# Altium schematic sheet main40v.SchDoc: DE:TMP:11:MAIN:STEP
size 139 x 96 mm; SheetNumber: 1; SheetTotal: 1; PageSetup: Record=PageOptions|CenterHorizontal=True|CenterVertical=True|PrintScale=1.97|XCorrection=1.00|YCorrection=1.00|PrintKind=0|BorderSize=5000000|LeftOffset=0|BottomOffset=0|Orientation=2|PaperLength=1000|PaperWidth=1000|Scale=100|PaperSource=7|PrintQuality=-4|MediaType=1|DitherType=10|PaperKind=Letter|PrintScaleMode=1; CurrentDateFGR: 21-07-2022; ModifiedDateFGR: 21-07-2022; WebFGR: www.abebashop.com; VersionFGR: 20220720
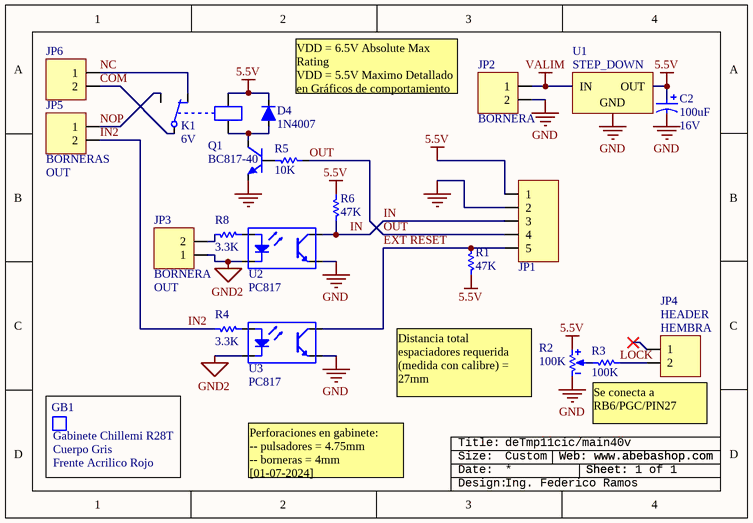
[diagram p0: main40v.SchDoc]

## Parts
C2  value 100uF  Voltaje: 16V  [C_EL_6-3X11]  (hidden comment: Cap Pol)
D4  1N4007  [DIODE300_1MM]
GB1  Gabinete Chillemi R28T  Codigo Chillemi: Cuerpo Gris  Dolares Chillemi: Frente Acrilico Rojo  [PLA_GAB_DIN_4X2_HALF]
JP1  Header5x1  [HDR5x1]  (value not drawn)
JP2  Codigo Elemon: BORNERA  [bornera2]  (hidden comment: XY128V-A2P)
JP3  OUT  Codigo Elemon: BORNERA  [bornera2]
JP4  HEMBRA  Price: HEADER  [HDR2x1]
JP5  Dolares Elemon: BORNERAS  [bornera2]  (hidden comment: XY128V-A2P)
JP6  XY128V-A2P  [bornera2]  (value not drawn)
K1  6V  [RLY_SI_10A_XXV]
Q1  BC817-40  [SOT23]
R1  Resistencia: 47K  [RES300TH]  (hidden comment: Resistencia 1206; 47Kohm)
R2  value 100K  [R_ADJ_METV]  (hidden comment: Preset)
R3  Resistencia: 100K  [R1206]  (hidden comment: Resistencia 1206; 47Kohm)
R4  Resistencia: 3.3K  [R1206]  (hidden comment: Resistencia 1206; 3.3Kohm)
R5  Resistencia: 10K  [R1206]  (hidden comment: Resistencia 1206; 10Kohm)
R6  Resistencia: 47K  [R1206]  (hidden comment: Resistencia 1206; 47Kohm)
R8  Resistencia: 3.3K  [R1206]  (hidden comment: Resistencia 1206; 3.3Kohm)
ROT?  Rotulo  (value not drawn)  (graphical)
U1  STEP_DOWN  [STEP DOWN 20180903 2150]
U2  PC817  [DIP4]
U3  PC817  [DIP4]

## Nets
5.5V: C2.1 D4.2 JP1.1 K1.4 R1.1 R2.1 R6.2 U1.3(OUT)
GND: C2.2 JP1.2 JP2.2 Q1.2(E) R2.3 U1.2(GND) U2.3(E) U3.3(E)
GND2: JP3.1 U2.2(K) U3.2(K)
VALIM: JP2.1 U1.1(IN)
COM: JP6.2 K1.1
EXT RESET: JP1.5 R1.2 U3.4(C)
IN: JP1.3 R6.1 U2.4(C)
IN2: JP5.2 R4.2
LOCK: JP4.2 R3.1
NC: JP6.1 K1.2
NOP: JP5.1 K1.3
OUT: JP1.4 R5.1
NetD4_1: D4.1 K1.5 Q1.3(C)
NetJP3_2: JP3.2 R8.2
NetQ1_1: Q1.1(B) R5.2
NetR2_2: R2.2 R3.2
NetR4_1: R4.1 U3.1(A)
NetR8_1: R8.1 U2.1(A)

Not connected (* = marked no-connect by the designer): JP4 1*

## Notes on the sheet
- (near D4) VDD = 6.5V Absolute Max Rating
  VDD = 5.5V Maximo Detallado en Gráficos de comportamiento (es decir, "recomendable de uso 100% seguro)
- Distancia total espaciadores requerida (medida con calibre) = 27mm
- Perforaciones en gabinete:
  -- pulsadores = 4.75mm
  -- borneras = 4mm
  [01-07-2024]
- Espacio debe sumar 27mm (espaciadores + tuercas + arandela) medir con calibre.
  ALTERNATIVAS YA UTILIZADAS:
  [A] Espaciador Polietileno 5mm (4.85mm exactos) +
  Esp PET 20mm (19.55 exacto) + Tuerca 2.7mm
  L Tornillo Usado = 38mm (cabeza Fresada)
  Altura Lograda con esta opción = 26.6mm
  (se puede sumar una arandela, con lo que sí puede obtener 27mm)
  Agujeros borneras = 4.75mm
  Agujeros pulsadores = 4mm
- deTmp11cic/main40v
- Custom
- (near ROT?) Web: www.abebashop.com
- Sheet: 1 of 1
- (near R2) Se conecta a RB6/PGC/PIN27
- Ing. Federico Ramos
- (in symbol Rotulo) Title:; Size:; Web: www.abebashop.com; Date:; Sheet:; Design:

## Library data of the parts
C2 = Cap Pol: Capacitor Polarizado; Price: ?
D4 = 1N4007: Codigo Elemon: DI1152060; Dolares Elemon: 0.01989
GB1 = Gabinete Chillemi R28T; Cuerpo Negro; Frente Acrilico Rojo
JP1 = Header5x1: Header 5x1; Price: ?
JP2 = Bornera Tornillos 2x1; Altura = 13.8mm: Dolares Elemon: OUT
JP3 = Bornera Tornillos 2x1; Altura = 13.8mm: Dolares Elemon: 0.27574
JP4 = Header2x1: Header 2x1
JP5 = Bornera Tornillos 2x1; Altura = 13.8mm: Codigo Elemon: BORNERA; OUT: OUT
JP6 = Bornera Tornillos 2x1; Altura = 13.8mm: Codigo Elemon: MC5811820; Dolares Elemon: 0.27574
K1 = Relay 24V; 1 Inversor: Codigo Elemon: RE4551630; Dolares Elemon: 1.24223
Q1 = BC817-40: Dolares Elemon: 0.03755; Codigo Elemon: TR1723021
R1 R3 R6 = Resistencia 1206; 47Kohm: Codigo Elemon: RS3886285; Dolares Elemon: 0.00717
R2 = Preset: Resistencia Variable
R4 R8 = Resistencia 1206; 3.3Kohm: Dolares Elemon: 0.00720; Codigo Elemon: RS3886215
R5 = Resistencia 1206; 10Kohm: Codigo Elemon: RS3886245; Dolares Elemon: 0.00718
ROT? = Rotulo: Rotulo [consolas]
U2 U3 = PC817: Codigo Elemon: OP1696350; Dolares Elemon: 0.20398